# Altium project DSP6748_F.PrjPcb
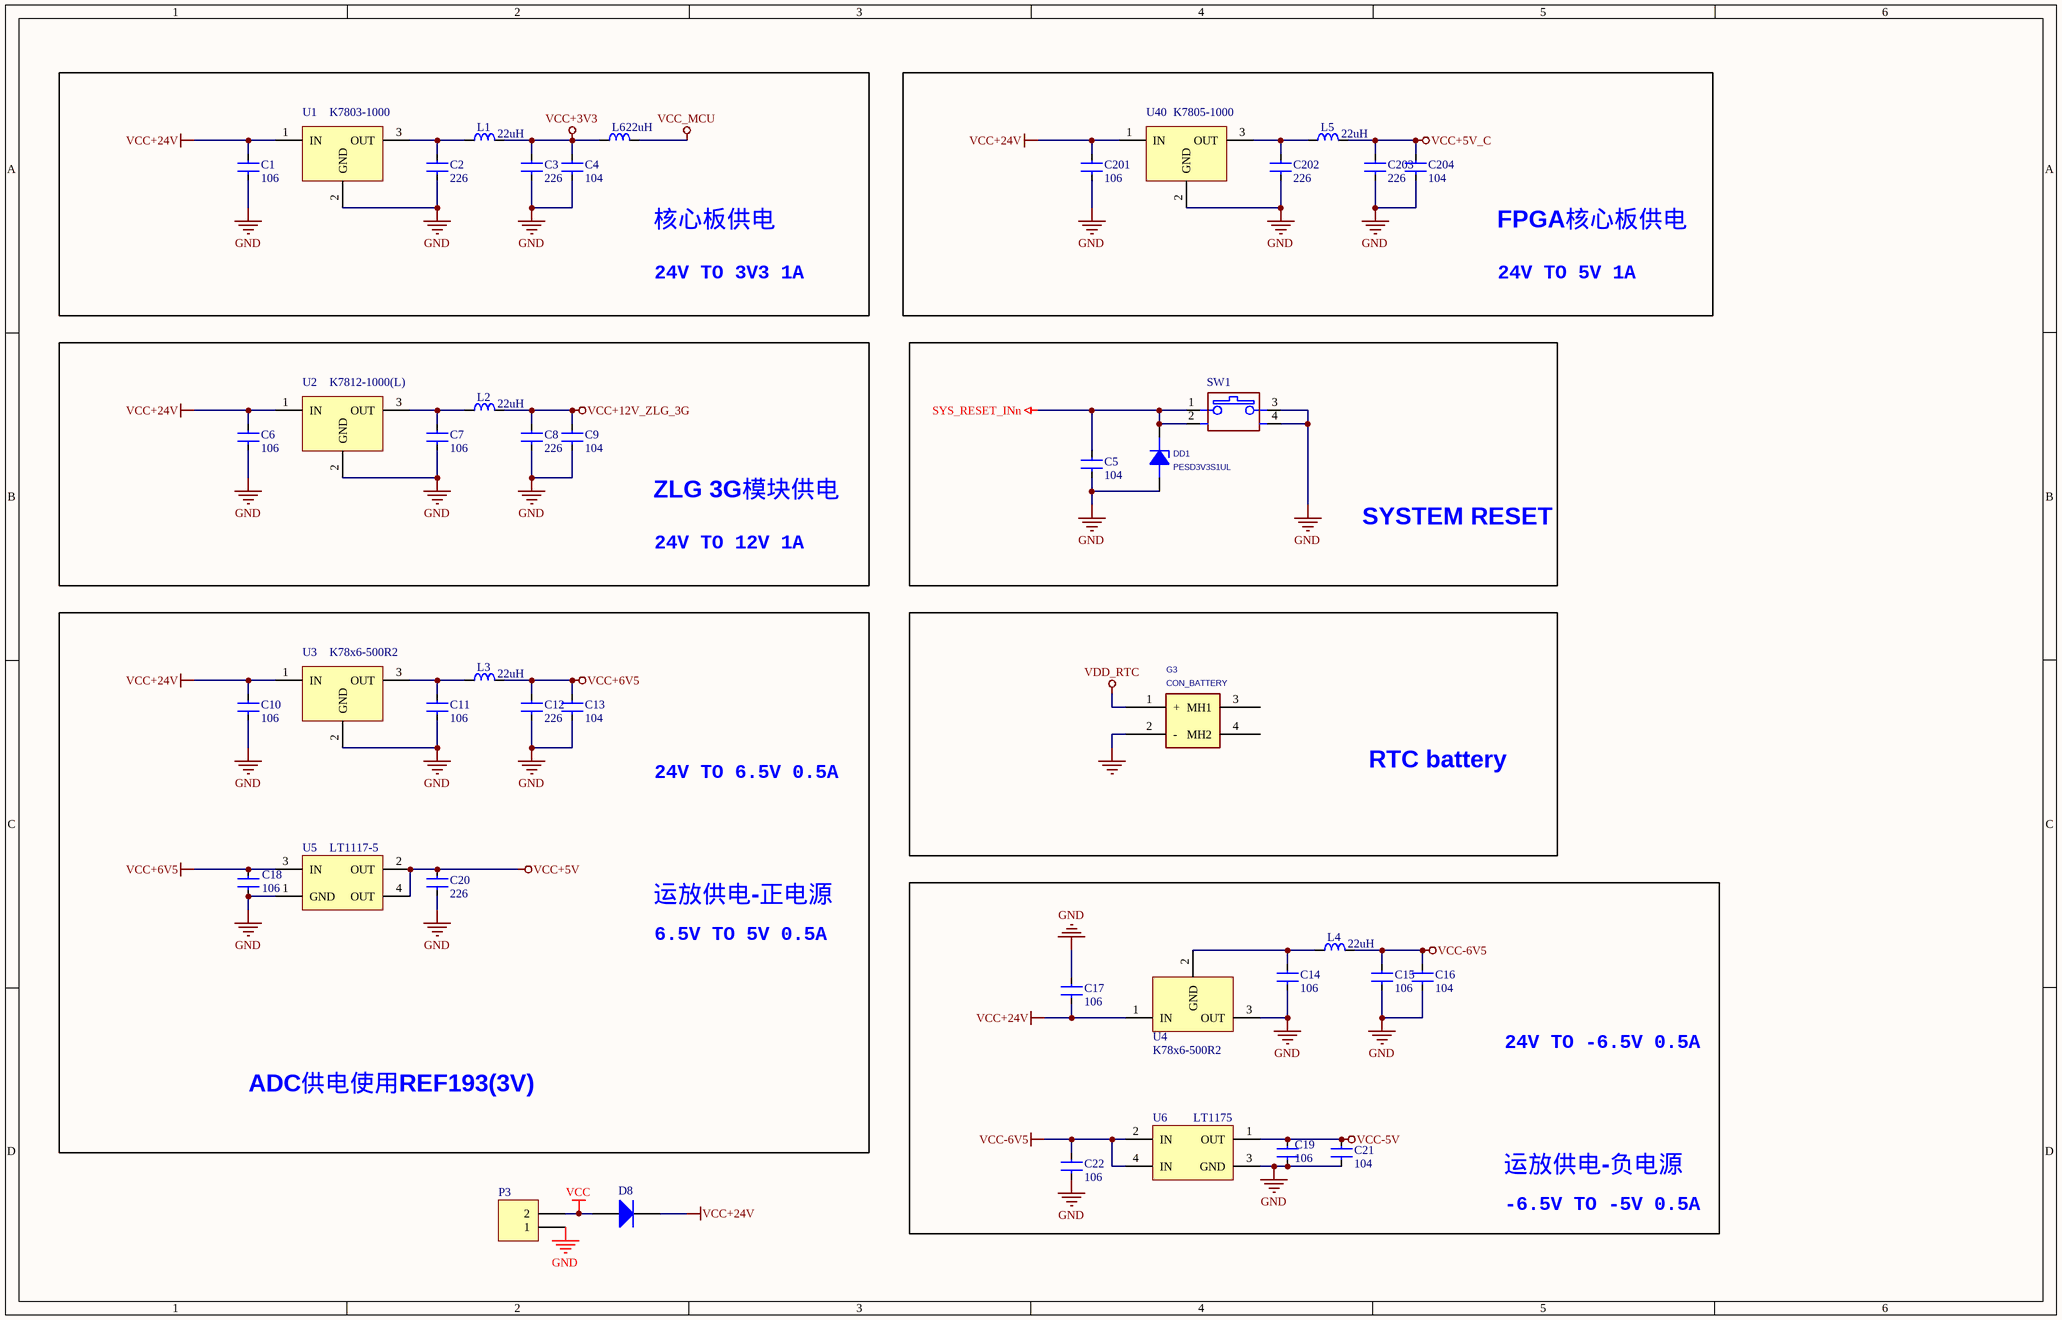
[diagram p0: Page A_Power.SchDoc]
4 sheets, 83 parts. Net scope: global (net labels, ports and power ports of the same name join across sheets).
Board file: DSP6748_F.PcbDoc
Sheets:
  Page A_Power.SchDoc
  Page E_Micro_SD.SchDoc
  Page K_B2B_D.SchDoc
  Page H_B2B_A.SchDoc

## Sheet Page A_Power.SchDoc
size 386 x 246 mm; SheetNumber: 0; SheetTotal: 0

### Parts
C1  106  [0805C]
C2  226  [0805C]
C3  226  [0805C]
C4  104  [0805C]
C5  104  [0805C]
C6  106  [0805C]
C7  106  [0805C]
C8  226  [0805C]
C9  104  [0805C]
C10  106  [0805C]
C11  106  [0805C]
C12  226  [0805C]
C13  104  [0805C]
C14  106  [0805C]
C15  106  [0805C]
C16  104  [0805C]
C17  106  [0805C]
C18  106  [0805C]
C19  106  [0805C]
C20  226  [0805C]
C21  104  [0805C]
C22  106  [0805C]
C201  106  [0805C]
C202  226  [0805C]
C203  226  [0805C]
C204  104  [0805C]
D8  1N4007  [DO-41]  (value not drawn)
DD1  PESD3V3S1UL  [SOD882]
G3  CON_BATTERY  [CON_BATTERY_CR1220]
L1  22uH  [1210]
L2  22uH  [1210]
L3  22uH  [1210]
L4  22uH  [1210]
L5  22uH  [1210]
L6  22uH  [1210]
P3  Header 2  [7.62-2P]  (value not drawn)
SW1  SW PUSHBUTTON-SPST SHIELD_0  [BUTTON_SW_SMD_4P_BIG]  (value not drawn)
U1  K7803-1000  [K78xx-500R2]
U2  K7812-1000(L)  [K78xx-L]
U3  K78x6-500R2  [K78xx-500R2]
U4  K78x6-500R2  [K78xx-500R2]
U5  LT1117-5  [SOT-223]
U6  LT1175  [SOT-223]
U40  K7805-1000  [K78xx-500R2]

### Blocks framed on the sheet
核心板供电: C1-C4 L1 L6 U1
FPGA核心板供电: C201-C204 L5 U40
ZLG 3G模块供电: C6-C9 L2 U2
SYSTEM RESET: C5 DD1 SW1
RTC battery: G3
运放供电-负电源: C14-C17 C19 C21 C22 L4 U4 U6

### Nets
GND: C1.2 C2.2 C3.2 C4.2 C5.2 C6.2 C7.2 C8.2 C9.2 C10.2 C11.2 C12.2 C13.2 C14.2 C15.2 C16.2 C17.2 C18.2 C19.2 C20.2 C21.2 C22.2 C201.2 C202.2 C203.2 C204.2 DD1.2(ANODE) G3.2(-) P3.1 SW1.3 SW1.4 U1.2(GND) U2.2(GND) U3.2(GND) U4.3(OUT) U5.1(GND) U6.3(GND) U40.2(GND)
SYS_RESET_INn: C5.1 DD1.1(CATHODE) SW1.1 SW1.2
VCC: D8.1(A) P3.2
VCC+3V3: C3.1 C4.1 L1.2 L6.1
VCC+5V: C20.1 U5.2(OUT) U5.4(OUT)
VCC+5V_C: C203.1 C204.1 L5.2
VCC+6V5: C12.1 C13.1 C18.1 L3.2 U5.3(IN)
VCC+12V_ZLG_3G: C8.1 C9.1 L2.2
VCC+24V: C1.1 C6.1 C10.1 C17.1 C201.1 D8.2(K) U1.1(IN) U2.1(IN) U3.1(IN) U4.1(IN) U40.1(IN)
VCC-5V: C19.1 C21.1 U6.1(OUT)
VCC-6V5: C15.1 C16.1 C22.1 L4.2 U6.2(IN) U6.4(IN)
VCC_MCU: L6.2
VDD_RTC: G3.1(+)
NetC2_1: C2.1 L1.1 U1.3(OUT)
NetC7_1: C7.1 L2.1 U2.3(OUT)
NetC11_1: C11.1 L3.1 U3.3(OUT)
NetC14_1: C14.1 L4.1 U4.2(GND)
NetC202_1: C202.1 L5.1 U40.3(OUT)

Not connected (* = marked no-connect by the designer): G3 3(MH1) 4(MH2)

### Notes on the sheet
- 24V TO 3V3 1A
- 24V TO 5V 1A
- 24V TO 12V 1A
- 24V TO 6.5V 0.5A
- 运放供电-正电源
- 6.5V TO 5V 0.5A
- 24V TO -6.5V 0.5A
- ADC供电使用REF193(3V)
- -6.5V TO -5V 0.5A

### Library data of the parts
C1-C18 C20 C201-C204 = C-SMD: SMD
C19 C21 C22 = C-X5R/X7R
D8 = Diode 1N4148: High Conductance Fast Diode; Published: 8-Jun-2000; LatestRevisionDate: 17-Jul-2002; LatestRevisionNote: Re-released for DXP Platform.; DatasheetDocument: 1997; PackageReference: DO-35; Publisher: Altium Limited; Code_JEDEC: DO-204-AH; ComponentLink1Description: Manufacturer Link; ComponentLink1URL: http://www.fairchildsemi.com/; ComponentLink2Description: Datasheet; ComponentLink2URL: http://www.fairchildsemi.com/ds/1N%2F1N4148.pdf
DD1 = DIODE BREAKDOWN: Manufacturer: NXP; Remark: ESD; Manufacturer PartNumber: PESD3V3S1UL
G3 = CON_BATTERY: Remark: CR1220纽扣电池座
L1-L6 = Inductor: Part Number: IND0603_TDK_MPZ1608R391A; Part Description: SMT Chip Bead for Power Line; Manufacturer: TDK; Manufacturer Part Number: MPZ1608R391A; Value: 390R@100MHz; Power: 1.2A; Resistance: 0.12R; Tolerance: ?5%; Table: Inductors SMD; Component Kind: Standard; Component Type: Standard; Footprint: INDC1608X95N; Pin Count: 2; Status: None; Case: 0603; Mounted: Yes; Socket: No; SMD: Yes; ComponentHeight: 0.95mm; HelpURL: \\cern.ch\dfs\Applications\Altium\Datasheets\IND0603_TDK_MPZ1608.pdf; Author: CERN DEM JLC; CreateDate: 02.12.2009; LatestRevisionDate: 02.12.2009
P3 = Header 2: Header, 2-Pin; LatestRevisionDate: 17-Jul-2002; LatestRevisionNote: Re-released for DXP Platform.; Publisher: Altium Limited
U1-U4 U40 = K78xx-500R2
U5 = AMS1117
SW1 = SW PUSHBUTTON-SPST SHIELD_0: Filename: *

## Sheet Page E_Micro_SD.SchDoc
size 386 x 246 mm; SheetNumber: 0; SheetTotal: 0
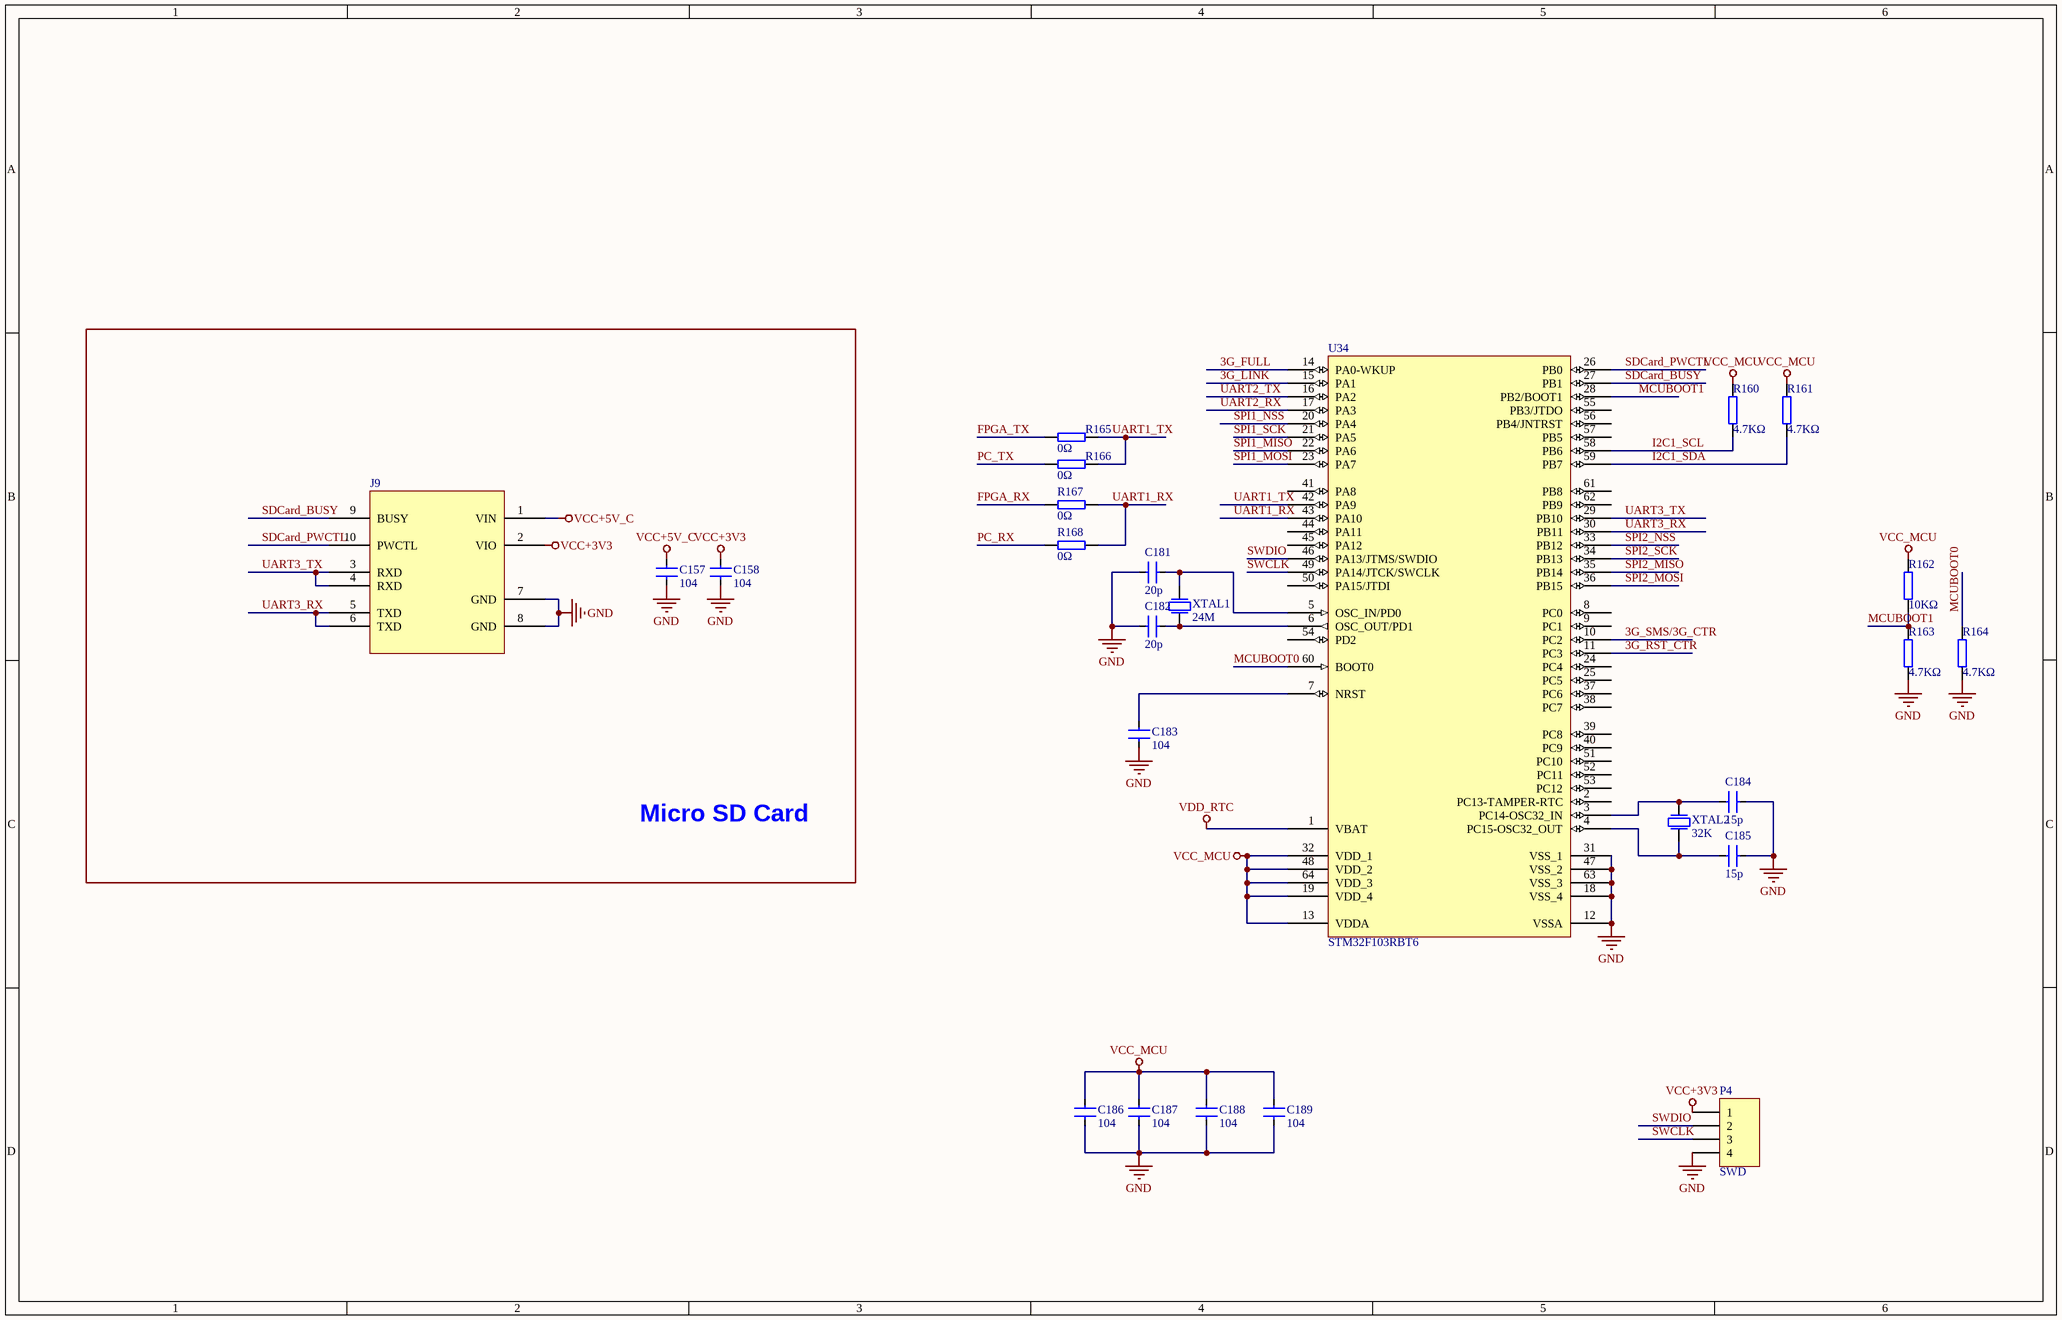
[diagram p1: Page E_Micro_SD.SchDoc]

### Parts
C157  104  [0603C]
C158  104  [0603C]
C181  20p  [0603C]
C182  20p  [0603C]
C183  104  [0603C]
C184  15p  [0603C]
C185  15p  [0603C]
C186  104  [0603C]
C187  104  [0603C]
C188  104  [0603C]
C189  104  [0603C]
J9  SDV600  [JTAG10PW]  (value not drawn)
P4  SWD  [HDR1X4]
R160  4.7KΩ  [0603R]
R161  4.7KΩ  [0603R]
R162  10KΩ  [0603R]
R163  4.7KΩ  [0603R]
R164  4.7KΩ  [0603R]
R165  0Ω  [0603R]
R166  0Ω  [0603R]
R167  0Ω  [0603R]
R168  0Ω  [0603R]
U34  STM32F103RBT6  [LQFP64_N]
XTAL1  24M  [XTAL2]
XTAL2  32K  [XTAL_32.768]

### Blocks framed on the sheet
Micro SD Card: C157 C158 J9

### Nets
GND: C157.1 C158.1 C181.2 C182.2 C183.1 C184.1 C185.1 C186.1 C187.1 C188.1 C189.1 J9.7(GND) J9.8(GND) P4.4 R163.2 R164.2 U34.12(VSSA) U34.18(VSS_4) U34.31(VSS_1) U34.47(VSS_2) U34.63(VSS_3)
VCC+3V3: C158.2 J9.2(VIO) P4.1
VCC+5V_C: C157.2 J9.1(VIN)
VCC_MCU: C186.2 C187.2 C188.2 C189.2 R160.1 R161.1 R162.1 U34.13(VDDA) U34.19(VDD_4) U34.32(VDD_1) U34.48(VDD_2) U34.64(VDD_3)
VDD_RTC: U34.1(VBAT)
3G_FULL: U34.14(PA0-WKUP)
3G_LINK: U34.15(PA1)
3G_RST_CTR: U34.11(PC3)
3G_SMS/3G_CTR: U34.10(PC2)
FPGA_RX: R167.1
FPGA_TX: R165.1
I2C1_SCL: R160.2 U34.58(PB6)
I2C1_SDA: R161.2 U34.59(PB7)
MCUBOOT0: R164.1 U34.60(BOOT0)
MCUBOOT1: R162.2 R163.1 U34.28(PB2/BOOT1)
PC_RX: R168.1
PC_TX: R166.1
SDCard_BUSY: J9.9(BUSY) U34.27(PB1)
SDCard_PWCTL: J9.10(PWCTL) U34.26(PB0)
SPI1_MISO: U34.22(PA6)
SPI1_MOSI: U34.23(PA7)
SPI1_NSS: U34.20(PA4)
SPI1_SCK: U34.21(PA5)
SPI2_MISO: U34.35(PB14)
SPI2_MOSI: U34.36(PB15)
SPI2_NSS: U34.33(PB12)
SPI2_SCK: U34.34(PB13)
SWCLK: P4.3 U34.49(PA14/JTCK/SWCLK)
SWDIO: P4.2 U34.46(PA13/JTMS/SWDIO)
UART1_RX: R167.2 R168.2 U34.43(PA10)
UART1_TX: R165.2 R166.2 U34.42(PA9)
UART2_RX: U34.17(PA3)
UART2_TX: U34.16(PA2)
UART3_RX: J9.5(TXD) J9.6(TXD) U34.30(PB11)
UART3_TX: J9.3(RXD) J9.4(RXD) U34.29(PB10)
NetC181_1: C181.1 U34.5(OSC_IN/PD0) XTAL1.1(P1)
NetC182_1: C182.1 U34.6(OSC_OUT/PD1) XTAL1.2(P2)
NetC183_2: C183.2 U34.7(NRST)
NetC184_2: C184.2 U34.3(PC14-OSC32_IN) XTAL2.1(P1)
NetC185_2: C185.2 U34.4(PC15-OSC32_OUT) XTAL2.2(P2)

Not connected (* = marked no-connect by the designer): U34 2(PC13-TAMPER-RTC) 8(PC0) 9(PC1) 24(PC4) 25(PC5) 37(PC6) 38(PC7) 39(PC8) 40(PC9) 41(PA8) 44(PA11) 45(PA12) 50(PA15/JTDI) 51(PC10) 52(PC11) 53(PC12) 54(PD2) 55(PB3/JTDO) 56(PB4/JNTRST) 57(PB5) 61(PB8) 62(PB9)

### Library data of the parts
C157 C158 C181-C189 = C-X5R/X7R
J9 = Uart0_SDCard
P4 = Header 4: Header, 4-Pin; LatestRevisionDate: 17-Jul-2002; LatestRevisionNote: Re-released for DXP Platform.; Publisher: Altium Limited
R160-R168 = 1K-0805R: Value: 1K
U34 = STM32F103RBT6: STM32 ARM-based 32-bit MCU with 128 Kbytes Flash, 64-pin LQFP, Industrial Temperature; Published: 30-May-2008; DatasheetVersion: rev6, Mar-2008; PackageVersion: Mar-2008; PackageReference: LQFP64; Publisher: Altium Limited; PackageDescription: 64-Pin Low-Profile Quad Flat Pack, 10 x 10 mm Body, 0.5 mm Pitch (LQFP64); ComponentLink1Description: Manufacturer Link; ComponentLink1URL: www.st.com/stm32; ComponentLink2Description: Datasheet; ComponentLink2URL: http://www.st.com/stonline/products/literature/ds/13587.pdf
XTAL1 XTAL2 = XTAL: CRYSTAL

## Sheet Page K_B2B_D.SchDoc
size 386 x 246 mm; SheetNumber: 0; SheetTotal: 0
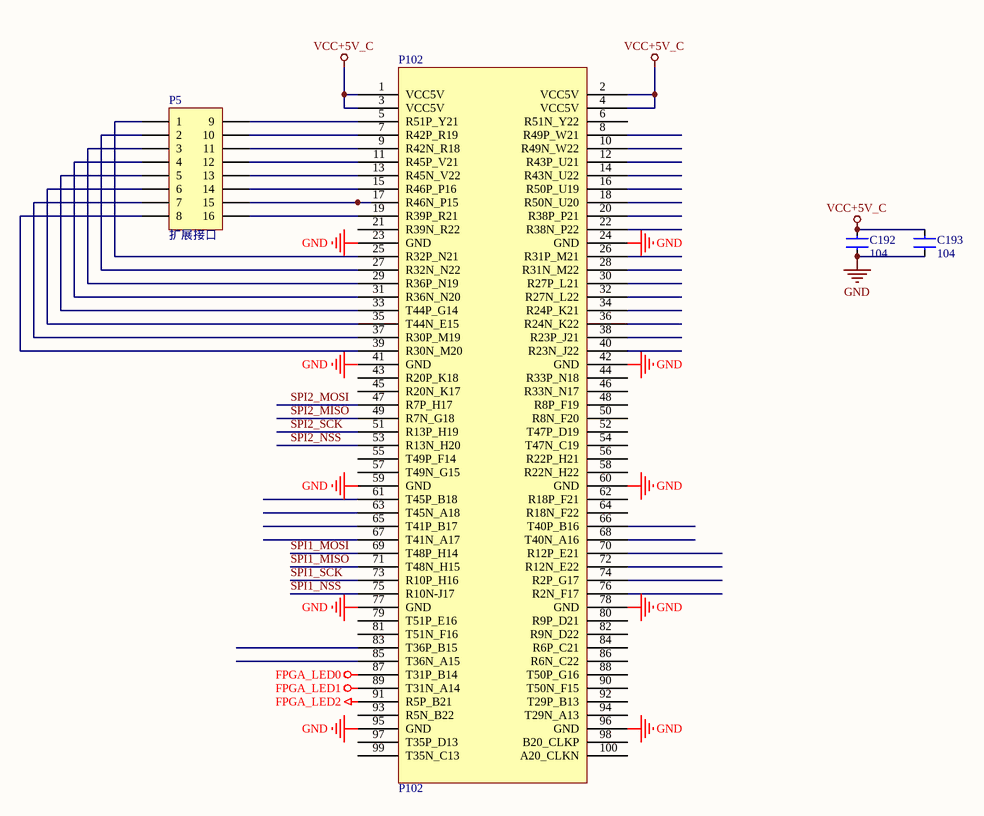
[diagram p2: Page K_B2B_D.SchDoc]

### Parts
C192  104  [0603C]
C193  104  [0603C]
P5  扩展接口  [HDR2X8_CEN]
P102  P102  [IDC100-05MM-SMD]

### Nets
FPGA_LED0: P102.87(T31P_B14)
FPGA_LED1: P102.89(T31N_A14)
FPGA_LED2: P102.91(R5P_B21)
GND: C192.1 C193.1 P102.23(GND) P102.24(GND) P102.41(GND) P102.42(GND) P102.59(GND) P102.60(GND) P102.77(GND) P102.78(GND) P102.95(GND) P102.96(GND)
VCC+5V_C: C192.2 C193.2 P102.1(VCC5V) P102.2(VCC5V) P102.3(VCC5V) P102.4(VCC5V)
SPI1_MISO: P102.71(T48N_H15)
SPI1_MOSI: P102.69(T48P_H14)
SPI1_NSS: P102.75(R10N-J17)
SPI1_SCK: P102.73(R10P_H16)
SPI2_MISO: P102.49(R7N_G18)
SPI2_MOSI: P102.47(R7P_H17)
SPI2_NSS: P102.53(R13N_H20)
SPI2_SCK: P102.51(R13P_H19)
NetP5_1: P5.1 P102.25(R32P_N21)
NetP5_2: P5.2 P102.27(R32N_N22)
NetP5_3: P5.3 P102.29(R36P_N19)
NetP5_4: P5.4 P102.31(R36N_N20)
NetP5_5: P5.5 P102.33(T44P_G14)
NetP5_6: P5.6 P102.35(T44N_E15)
NetP5_7: P5.7 P102.37(R30P_M19)
NetP5_8: P5.8 P102.39(R30N_M20)
NetP5_9: P5.9 P102.5(R51P_Y21)
NetP5_10: P5.10 P102.7(R42P_R19)
NetP5_11: P5.11 P102.9(R42N_R18)
NetP5_12: P5.12 P102.11(R45P_V21)
NetP5_13: P5.13 P102.13(R45N_V22)
NetP5_14: P5.14 P102.15(R46P_P16)
NetP5_15: P5.15 P102.17(R46N_P15)
NetP5_16: P5.16 P102.19(R39P_R21)

Not connected (* = marked no-connect by the designer): P102 6(R51N_Y22) 8(R49P_W21) 10(R49N_W22) 12(R43P_U21) 14(R43N_U22) 16(R50P_U19) 18(R50N_U20) 20(R38P_P21) 21(R39N_R22) 22(R38N_P22) 26(R31P_M21) 28(R31N_M22) 30(R27P_L21) 32(R27N_L22) 34(R24P_K21) 36(R24N_K22) 38(R23P_J21) 40(R23N_J22) 43(R20P_K18) 44(R33P_N18) 45(R20N_K17) 46(R33N_N17) 48(R8P_F19) 50(R8N_F20) 52(T47P_D19) 54(T47N_C19) 55(T49P_F14) 56(R22P_H21) 57(T49N_G15) 58(R22N_H22) 61(T45P_B18) 62(R18P_F21) 63(T45N_A18) 64(R18N_F22) 65(T41P_B17) 66(T40P_B16) 67(T41N_A17) 68(T40N_A16) 70(R12P_E21) 72(R12N_E22) 74(R2P_G17) 76(R2N_F17) 79(T51P_E16) 80(R9P_D21) 81(T51N_F16) 82(R9N_D22) 83(T36P_B15) 84(R6P_C21) 85(T36N_A15) 86(R6N_C22) 88(T50P_G16) 90(T50N_F15) 92(T29P_B13) 93(R5N_B22) 94(T29N_A13) 97(T35P_D13) 98(B20_CLKP) 99(T35N_C13) 100(A20_CLKN)

### Library data of the parts
C192 C193 = C-X5R/X7R
P5 = Header 8X2A: Header, 8-Pin, Dual row; LatestRevisionDate: 17-Jul-2002; LatestRevisionNote: Re-released for DXP Platform.; Publisher: Altium Limited
P102 = IDC102

## Sheet Page H_B2B_A.SchDoc
size 386 x 246 mm; SheetNumber: 0; SheetTotal: 0
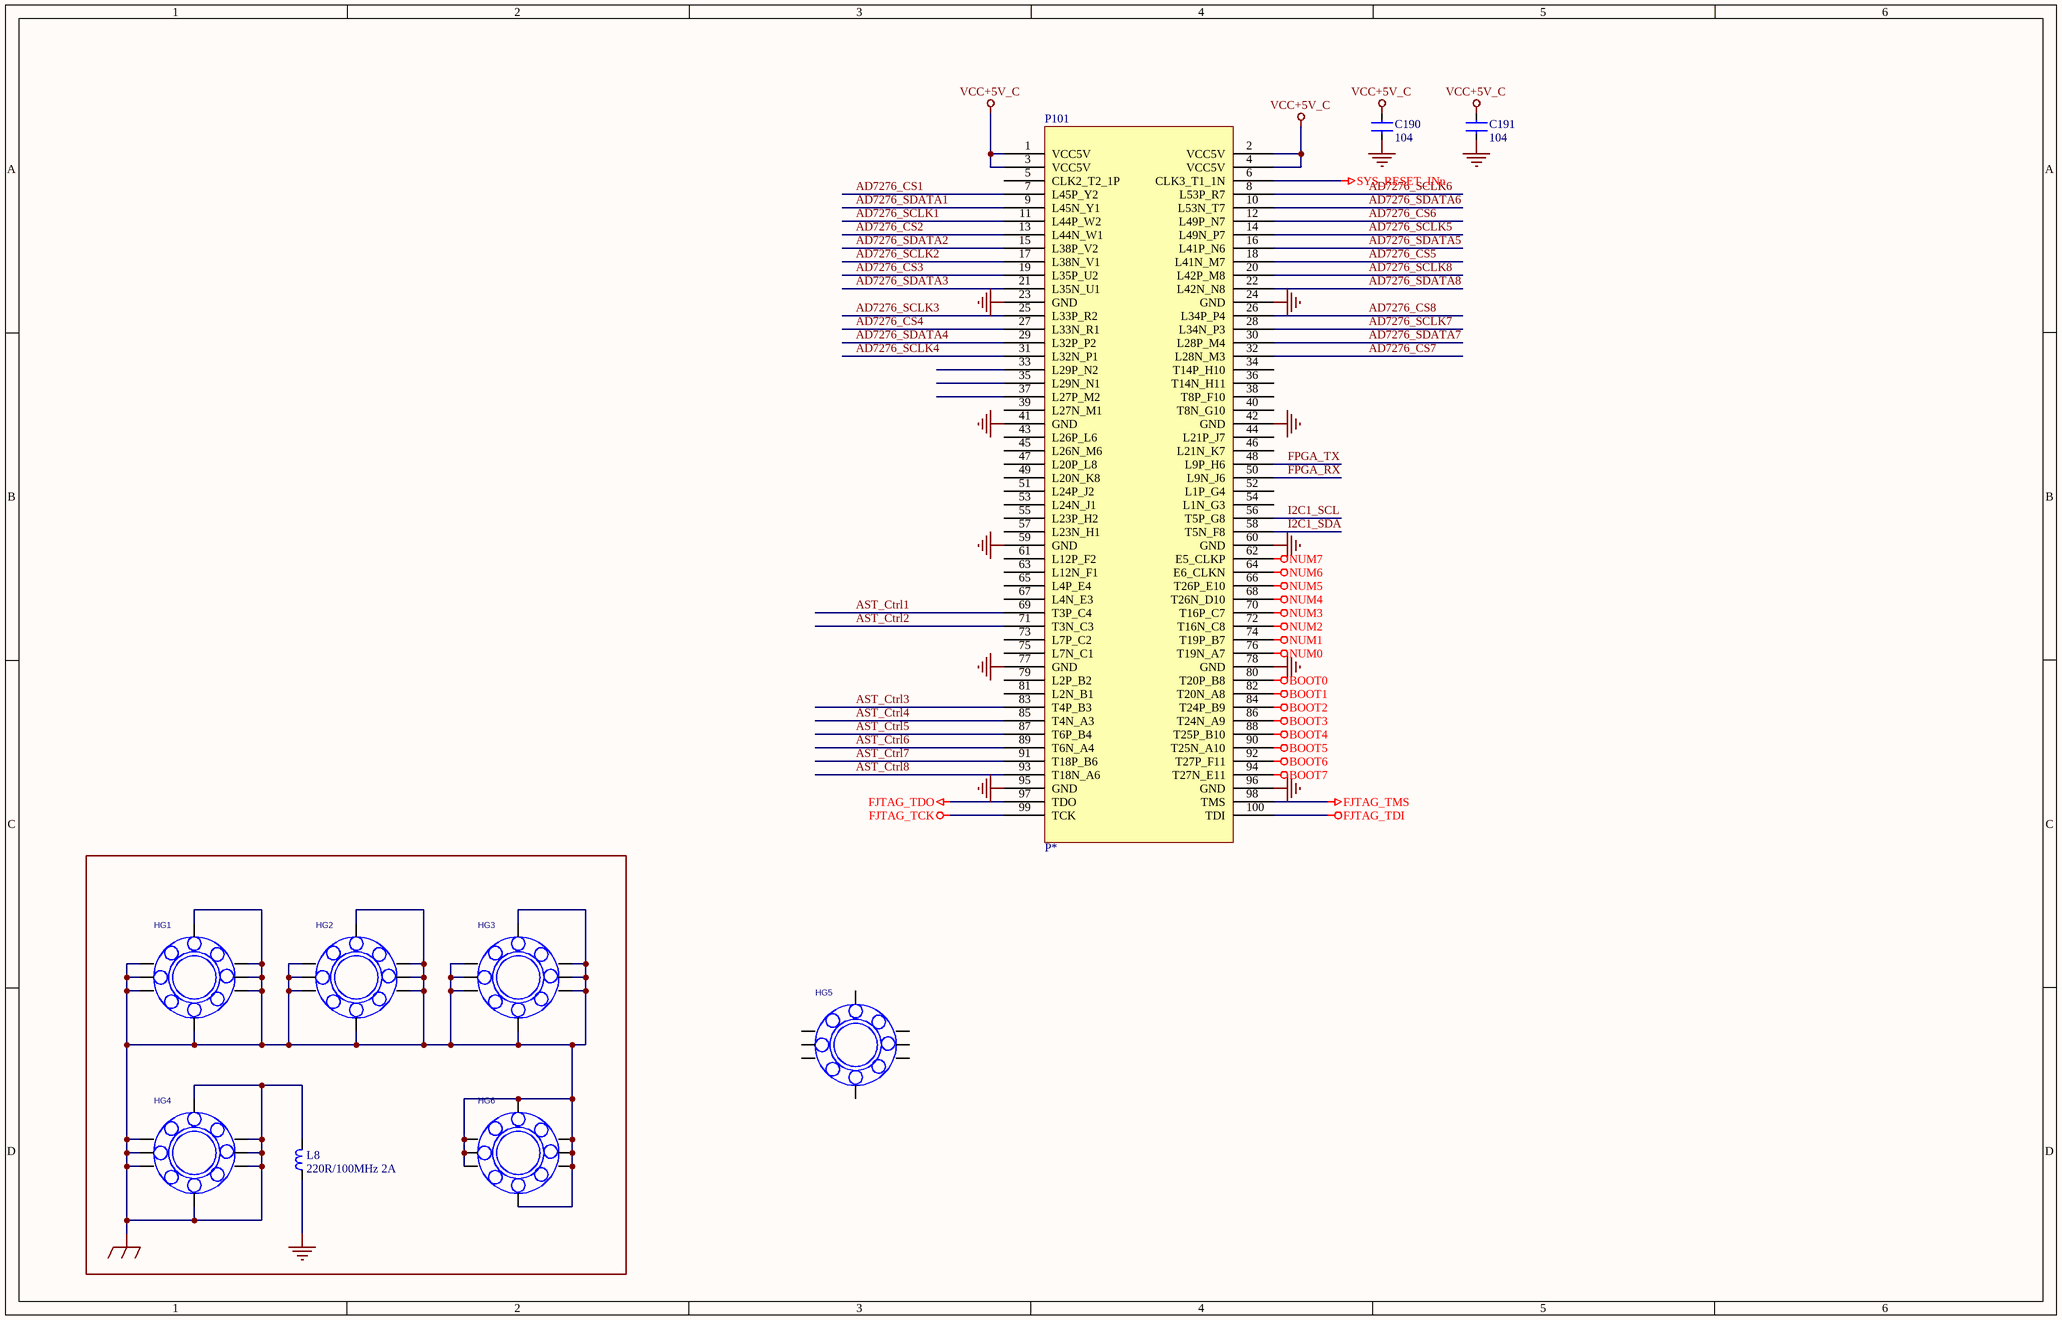
[diagram p3: Page H_B2B_A.SchDoc]

### Parts
C190  104  [0603C]
C191  104  [0603C]
HG1  MOUNTING_HOLE_NL  [th126_196c_13c]  (value not drawn)
HG2  MOUNTING_HOLE_NL  [th126_196c_13c]  (value not drawn)
HG3  MOUNTING_HOLE_NL  [th126_196c_13c]  (value not drawn)
HG4  MOUNTING_HOLE_NL  [th126_196c_13c]  (value not drawn)
HG5  MOUNTING_HOLE_NL  [th126_196c_13c]  (value not drawn)
HG6  MOUNTING_HOLE_NL  [th126_196c_13c]  (value not drawn)
L8  220R/100MHz 2A  [0603R]
P101  P*  [IDC100-05MM-SMD]

### Nets
BOOT0: P101.80(T20P_B8)
BOOT1: P101.82(T20N_A8)
BOOT2: P101.84(T24P_B9)
BOOT3: P101.86(T24N_A9)
BOOT4: P101.88(T25P_B10)
BOOT5: P101.90(T25N_A10)
BOOT6: P101.92(T27P_F11)
BOOT7: P101.94(T27N_E11)
FJTAG_TCK: P101.99(TCK)
FJTAG_TDI: P101.100(TDI)
FJTAG_TDO: P101.97(TDO)
FJTAG_TMS: P101.98(TMS)
GND: C190.1 C191.1 L8.1 P101.23(GND) P101.24(GND) P101.41(GND) P101.42(GND) P101.59(GND) P101.60(GND) P101.77(GND) P101.78(GND) P101.95(GND) P101.96(GND)
GND_EARTH: HG1.1(G1) HG1.2(G2) HG1.3(G3) HG1.4(G4) HG1.5(G5) HG1.6(G6) HG1.7(G7) HG1.8(G8) HG2.1(G1) HG2.2(G2) HG2.3(G3) HG2.4(G4) HG2.5(G5) HG2.6(G6) HG2.7(G7) HG2.8(G8) HG3.1(G1) HG3.2(G2) HG3.3(G3) HG3.4(G4) HG3.5(G5) HG3.6(G6) HG3.7(G7) HG3.8(G8) HG4.1(G1) HG4.2(G2) HG4.3(G3) HG4.4(G4) HG4.5(G5) HG4.6(G6) HG4.7(G7) HG4.8(G8) HG6.1(G1) HG6.2(G2) HG6.3(G3) HG6.4(G4) HG6.5(G5) HG6.6(G6) HG6.7(G7) HG6.8(G8) L8.2
NUM0: P101.76(T19N_A7)
NUM1: P101.74(T19P_B7)
NUM2: P101.72(T16N_C8)
NUM3: P101.70(T16P_C7)
NUM4: P101.68(T26N_D10)
NUM5: P101.66(T26P_E10)
NUM6: P101.64(E6_CLKN)
NUM7: P101.62(E5_CLKP)
SYS_RESET_INn: P101.6(CLK3_T1_1N)
VCC+5V_C: C190.2 C191.2 P101.1(VCC5V) P101.2(VCC5V) P101.3(VCC5V) P101.4(VCC5V)
AD7276_CS1: P101.7(L45P_Y2)
AD7276_CS2: P101.13(L44N_W1)
AD7276_CS3: P101.19(L35P_U2)
AD7276_CS4: P101.27(L33N_R1)
AD7276_CS5: P101.18(L41N_M7)
AD7276_CS6: P101.12(L49P_N7)
AD7276_CS7: P101.32(L28N_M3)
AD7276_CS8: P101.26(L34P_P4)
AD7276_SCLK1: P101.11(L44P_W2)
AD7276_SCLK2: P101.17(L38N_V1)
AD7276_SCLK3: P101.25(L33P_R2)
AD7276_SCLK4: P101.31(L32N_P1)
AD7276_SCLK5: P101.14(L49N_P7)
AD7276_SCLK6: P101.8(L53P_R7)
AD7276_SCLK7: P101.28(L34N_P3)
AD7276_SCLK8: P101.20(L42P_M8)
AD7276_SDATA1: P101.9(L45N_Y1)
AD7276_SDATA2: P101.15(L38P_V2)
AD7276_SDATA3: P101.21(L35N_U1)
AD7276_SDATA4: P101.29(L32P_P2)
AD7276_SDATA5: P101.16(L41P_N6)
AD7276_SDATA6: P101.10(L53N_T7)
AD7276_SDATA7: P101.30(L28P_M4)
AD7276_SDATA8: P101.22(L42N_N8)
AST_Ctrl1: P101.69(T3P_C4)
AST_Ctrl2: P101.71(T3N_C3)
AST_Ctrl3: P101.83(T4P_B3)
AST_Ctrl4: P101.85(T4N_A3)
AST_Ctrl5: P101.87(T6P_B4)
AST_Ctrl6: P101.89(T6N_A4)
AST_Ctrl7: P101.91(T18P_B6)
AST_Ctrl8: P101.93(T18N_A6)
FPGA_RX: P101.50(L9N_J6)
FPGA_TX: P101.48(L9P_H6)
I2C1_SCL: P101.56(T5P_G8)
I2C1_SDA: P101.58(T5N_F8)

Not connected (* = marked no-connect by the designer): HG5 1(G1) 2(G2) 3(G3) 4(G4) 5(G5) 6(G6) 7(G7) 8(G8); P101 5(CLK2_T2_1P) 33(L29P_N2) 34(T14P_H10) 35(L29N_N1) 36(T14N_H11) 37(L27P_M2) 38(T8P_F10) 39(L27N_M1) 40(T8N_G10) 43(L26P_L6) 44(L21P_J7) 45(L26N_M6) 46(L21N_K7) 47(L20P_L8) 49(L20N_K8) 51(L24P_J2) 52(L1P_G4) 53(L24N_J1) 54(L1N_G3) 55(L23P_H2) 57(L23N_H1) 61(L12P_F2) 63(L12N_F1) 65(L4P_E4) 67(L4N_E3) 73(L7P_C2) 75(L7N_C1) 79(L2P_B2) 81(L2N_B1)

### Library data of the parts
C190 C191 = C-X5R/X7R
HG1-HG6 = MOUNTING_HOLE: Sym, PCB mounting holes, th126_196c_13c; Install: No; Remark: 孔
L8 = Inductor
P101 = IDC100

## Nets that join several sheets
GND: Page A_Power (38 pins), Page E_Micro_SD (21 pins), Page K_B2B_D (12 pins), Page H_B2B_A (13 pins)
SYS_RESET_INn: Page A_Power (C5.1 DD1.1 SW1.1 SW1.2), Page H_B2B_A (P101.6)
VCC+3V3: Page A_Power (C3.1 C4.1 L1.2 L6.1), Page E_Micro_SD (C158.2 J9.2 P4.1)
VCC+5V_C: Page A_Power (C203.1 C204.1 L5.2), Page E_Micro_SD (C157.2 J9.1), Page K_B2B_D (6 pins), Page H_B2B_A (6 pins)
VCC_MCU: Page A_Power (L6.2), Page E_Micro_SD (12 pins)
VDD_RTC: Page A_Power (G3.1), Page E_Micro_SD (U34.1)
FPGA_RX: Page E_Micro_SD (R167.1), Page H_B2B_A (P101.50)
FPGA_TX: Page E_Micro_SD (R165.1), Page H_B2B_A (P101.48)
I2C1_SCL: Page E_Micro_SD (R160.2 U34.58), Page H_B2B_A (P101.56)
I2C1_SDA: Page E_Micro_SD (R161.2 U34.59), Page H_B2B_A (P101.58)
SPI1_MISO: Page E_Micro_SD (U34.22), Page K_B2B_D (P102.71)
SPI1_MOSI: Page E_Micro_SD (U34.23), Page K_B2B_D (P102.69)
SPI1_NSS: Page E_Micro_SD (U34.20), Page K_B2B_D (P102.75)
SPI1_SCK: Page E_Micro_SD (U34.21), Page K_B2B_D (P102.73)
SPI2_MISO: Page E_Micro_SD (U34.35), Page K_B2B_D (P102.49)
SPI2_MOSI: Page E_Micro_SD (U34.36), Page K_B2B_D (P102.47)
SPI2_NSS: Page E_Micro_SD (U34.33), Page K_B2B_D (P102.53)
SPI2_SCK: Page E_Micro_SD (U34.34), Page K_B2B_D (P102.51)